# EAGLE design mapleSDuino-V0.1_007-eagle7 (EAGLE 7.6.0)
MAPLE-CUx Large Version
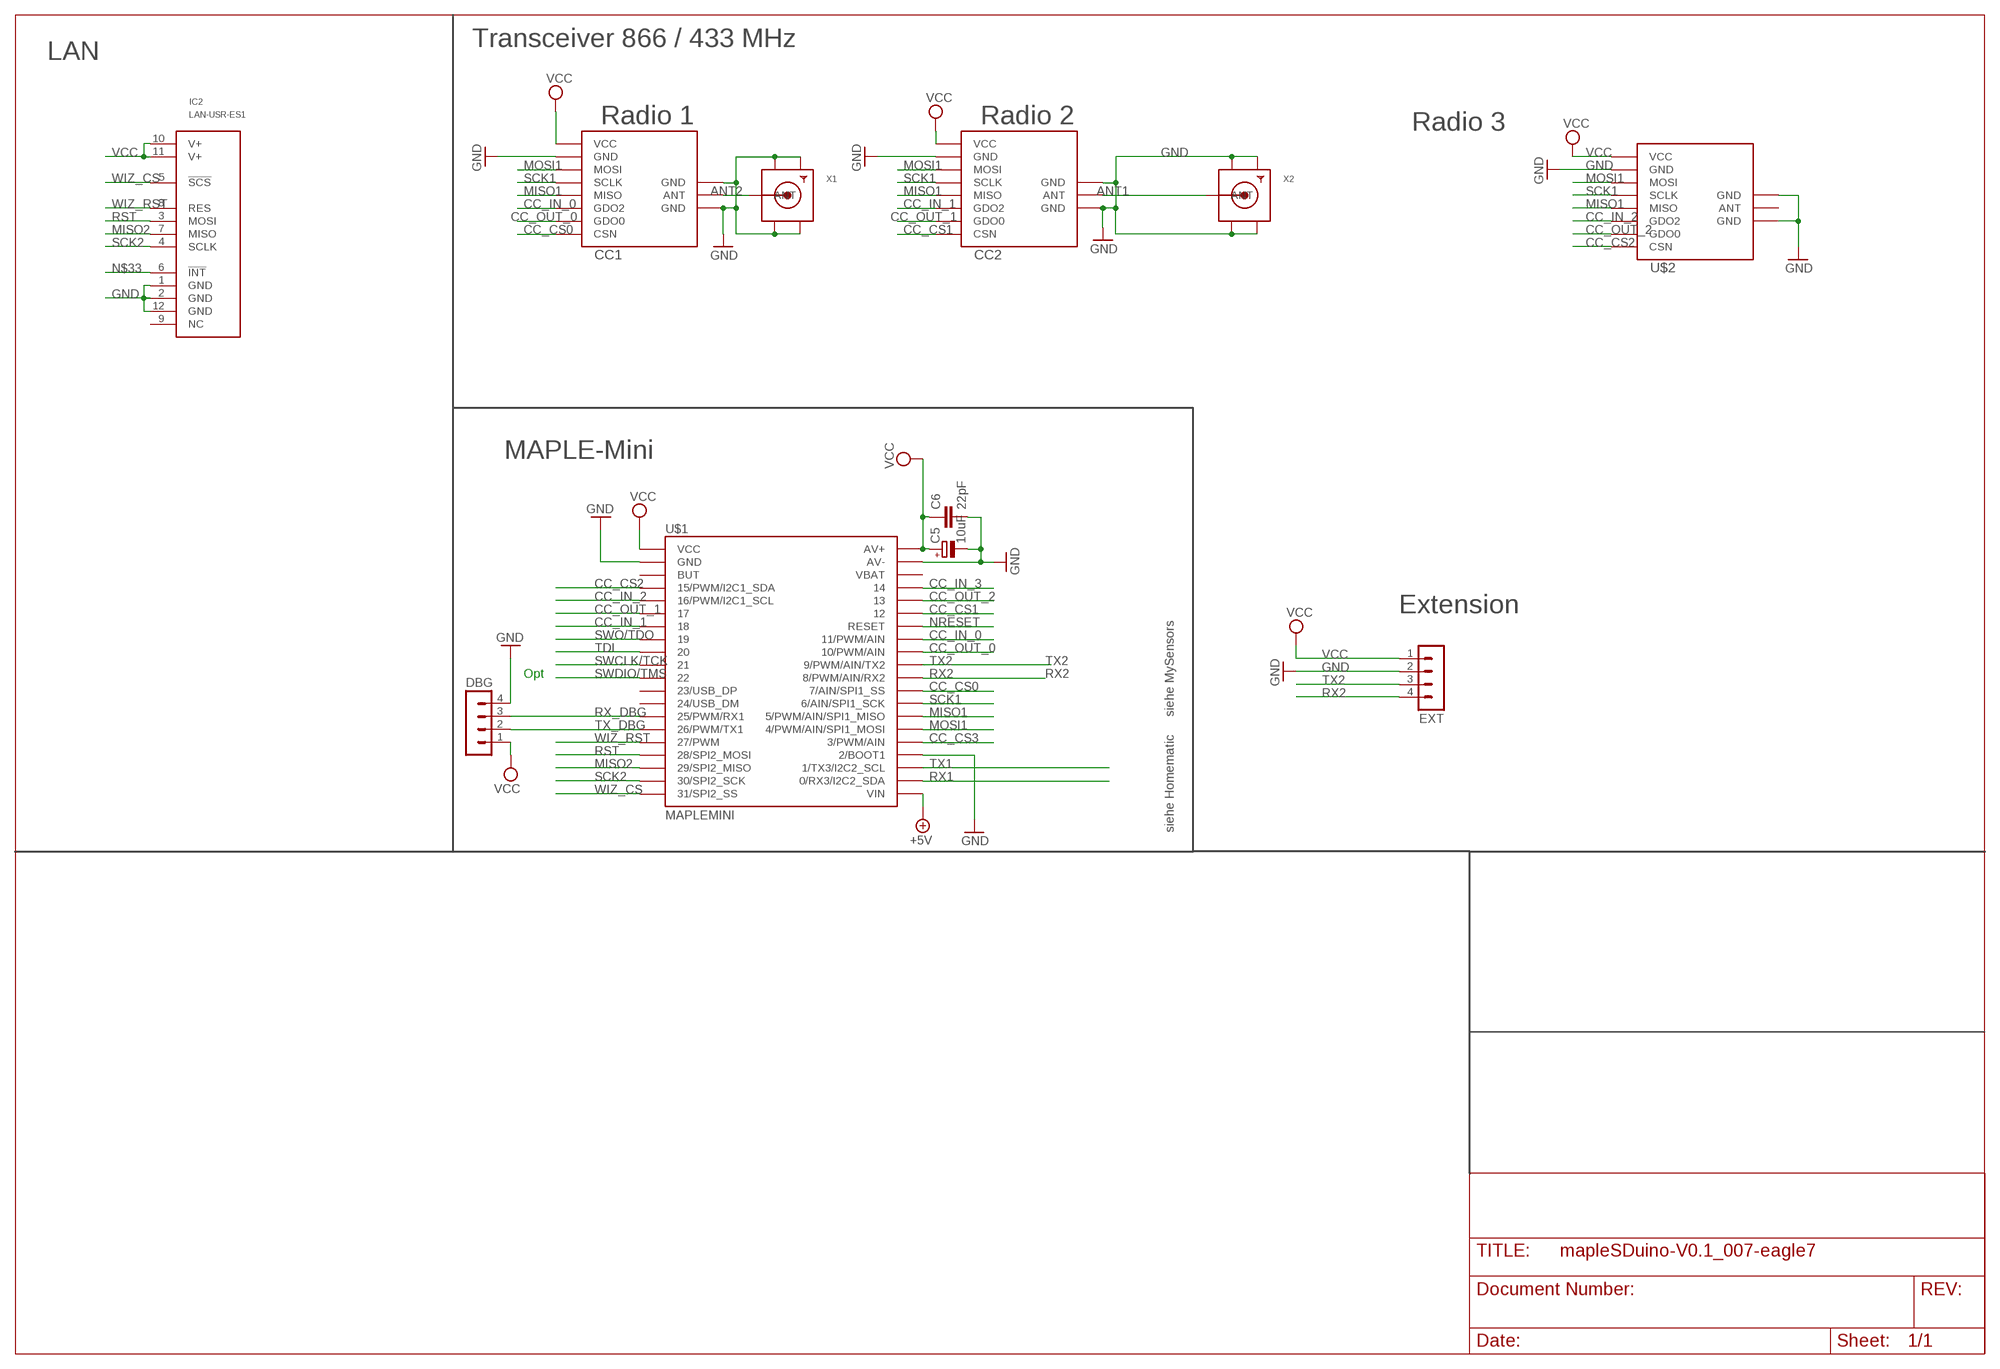
[diagram p0: schematic, sheet 1]

## Parts
C5  10uF  CPOL-EUR/2012-12W  [R/2012-12W]
C6  22pF  C-EUC0805  [C0805]
CC1  CC1101  CC1101_MODULE1SMD  [CC1101_MODULE1_SMD]
CC2  CC1101_MODULE1SMD  [CC1101_MODULE1_SMD]
DBG  MA04-1  [MA04-1]
EXT  MA04-1  [MA04-1]
IC2  LAN-USR-ES1  [USR-ES1]
U$1  MAPLEMINI  [20-DIP]
U$2  CC1101_MODULE1DIL_BIG  [CC1101_MODULE1_DIL-2]
X1  SMACONNECTOR_EDGE  [SMA_EDGELAUNCH]
X2  SMACONNECTOR_EDGE  [SMA_EDGELAUNCH]

## Nets
+5V [PWR]: U$1.21(VIN)
ANT1 [PWR]: CC2.ANT X2.P(ANT)
ANT2: CC1.ANT X1.P(ANT)
CC_CS0: CC1.CSN U$1.29(7/AIN/SPI1_SS)
CC_CS1: CC2.CSN U$1.35
CC_CS2: U$1.4(15/PWM/I2C1_SDA) U$2.8(CSN)
CC_CS3: U$1.25(3/PWM/AIN)
CC_IN_0: CC1.GDO2 U$1.33(11/PWM/AIN)
CC_IN_1: CC2.GDO2 U$1.7
CC_IN_2: U$1.5(16/PWM/I2C1_SCL) U$2.6(GDO2)
CC_IN_3: U$1.37
CC_OUT_0: CC1.GDO0 U$1.32(10/PWM/AIN)
CC_OUT_1: CC2.GDO0 U$1.6
CC_OUT_2: U$1.36 U$2.7(GDO0)
GND [PWR]: C5.- C6.2 CC1.GND@0(GND) CC1.GND@1(GND) CC1.GND@2(GND) CC2.GND@0(GND) CC2.GND@1(GND) CC2.GND@2(GND) DBG.4 EXT.2 IC2.1(GND) IC2.2(GND) IC2.12(GND) U$1.2(GND) U$1.24(2/BOOT1) U$1.39(AV-) U$2.2(GND) U$2.9(GND) U$2.11(GND) X1.GND@1(GND4) X1.GND@2(GND3) X1.GND@3(GND2) X1.GND@4(GND1) X2.GND@1(GND4) X2.GND@2(GND3) X2.GND@3(GND2) X2.GND@4(GND1)
MISO1: CC1.MISO CC2.MISO U$1.27(5/PWM/AIN/SPI1_MISO) U$2.5(MISO)
MISO2: IC2.7(MISO) U$1.18(29/SPI2_MISO)
MOSI1: CC1.MOSI CC2.MOSI U$1.26(4/PWM/AIN/SPI1_MOSI) U$2.3(MOSI)
N$33: IC2.6(!INT!)
NRESET: U$1.34(RESET)
RST: IC2.3(MOSI) U$1.17(28/SPI2_MOSI)
RX1: U$1.22(0/RX3/I2C2_SDA)
RX2: EXT.4 U$1.30(8/PWM/AIN/RX2)
RX_DBG: DBG.3 U$1.14(25/PWM/RX1)
SCK1: CC1.SCLK CC2.SCLK U$1.28(6/AIN/SPI1_SCK) U$2.4(SCLK)
SCK2: IC2.4(SCLK) U$1.19(30/SPI2_SCK)
SWCLK/TCK: U$1.10
SWDIO/TMS: U$1.11
SWO/TDO: U$1.8
TDI: U$1.9
TX1: U$1.23(1/TX3/I2C2_SCL)
TX2: EXT.3 U$1.31(9/PWM/AIN/TX2)
TX_DBG: DBG.2 U$1.15(26/PWM/TX1)
VCC [PWR]: C5.+ C6.1 CC1.VCC CC2.VCC DBG.1 EXT.1 IC2.10(V+) IC2.11(V+) U$1.1(VCC) U$1.40(AV+) U$2.1(VCC)
WIZ_CS: IC2.5(!SCS!) U$1.20(31/SPI2_SS)
WIZ_RST: IC2.8(RES) U$1.16(27/PWM)
Unconnected: IC2.9(NC) U$1.3(BUT) U$1.12(23/USB_DP) U$1.13(24/USB_DM) U$1.38(VBAT) U$2.10(ANT)

## Notes on the sheet
- Transceiver 866 / 433 MHz
- LAN
- Radio 1 | Radio 2 | Radio 3
- MAPLE-Mini
- Extension
- Opt
- siehe MySensors
- siehe Homematic

## Library data of the parts
C5 = rcl:CPOL-EU: POLARIZED CAPACITOR, European symbol
C6 = rcl:C-EU: CAPACITOR, European symbol
CC1 CC2 = wireless:CC1101_MODULE1: CC1101 wireless module for 433/868 MHz (sold from Aliexpress). DIL version for mounting with pin header (and SMD soldering) and SMD only variant available.
DBG EXT = con-lstb:MA04-1: PIN HEADER; OC_FARNELL: unknown; OC_NEWARK: unknown
IC2 = Martin-Communication:LAN-USR-ES1
U$1 = maplemini-small:MAPLEMINI
U$2 = CC1101:CC1101_MODULE1: CC1101 wireless module for 433/868 MHz (sold from Aliexpress). DIL version for mounting with pin header (and SMD soldering) and SMD only variant available.
X1 X2 = adafruit:SMACONNECTOR: SMA Connector 90° DIP SMA Connector, 50 Ohm (4UConnector: 07259)

## Net classes
0 default: width 0.305 mm
1 PWR: width 0.406 mm

## Board
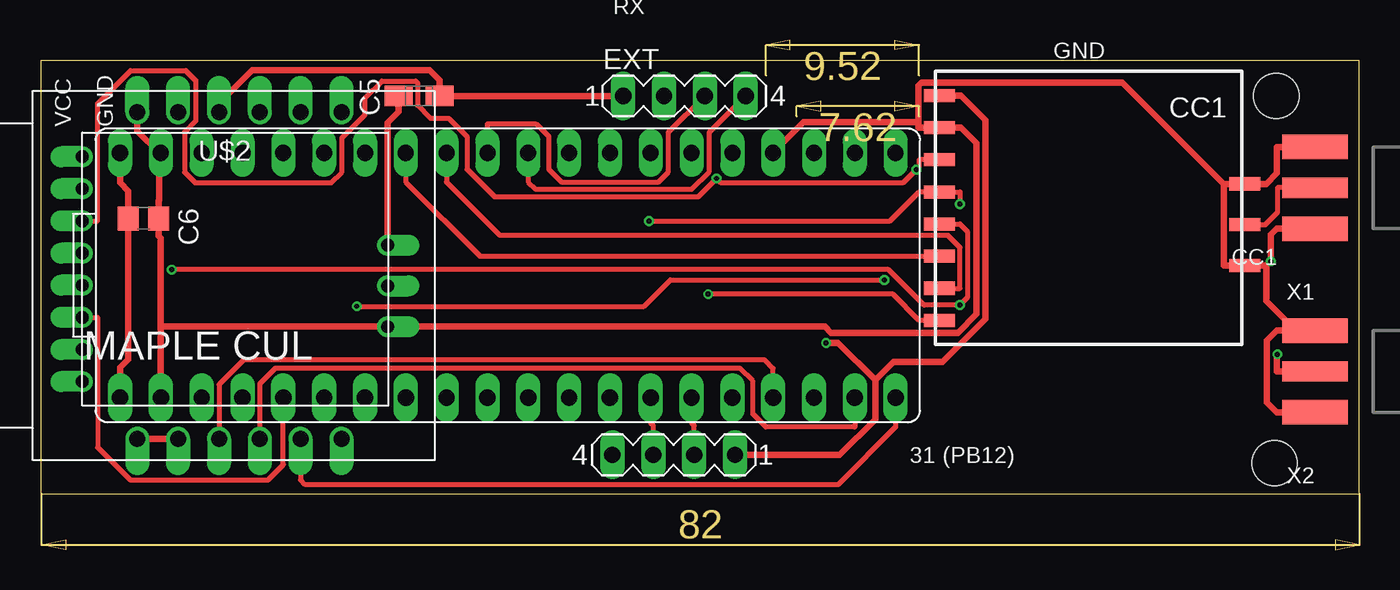
[diagram p1: board, top side]
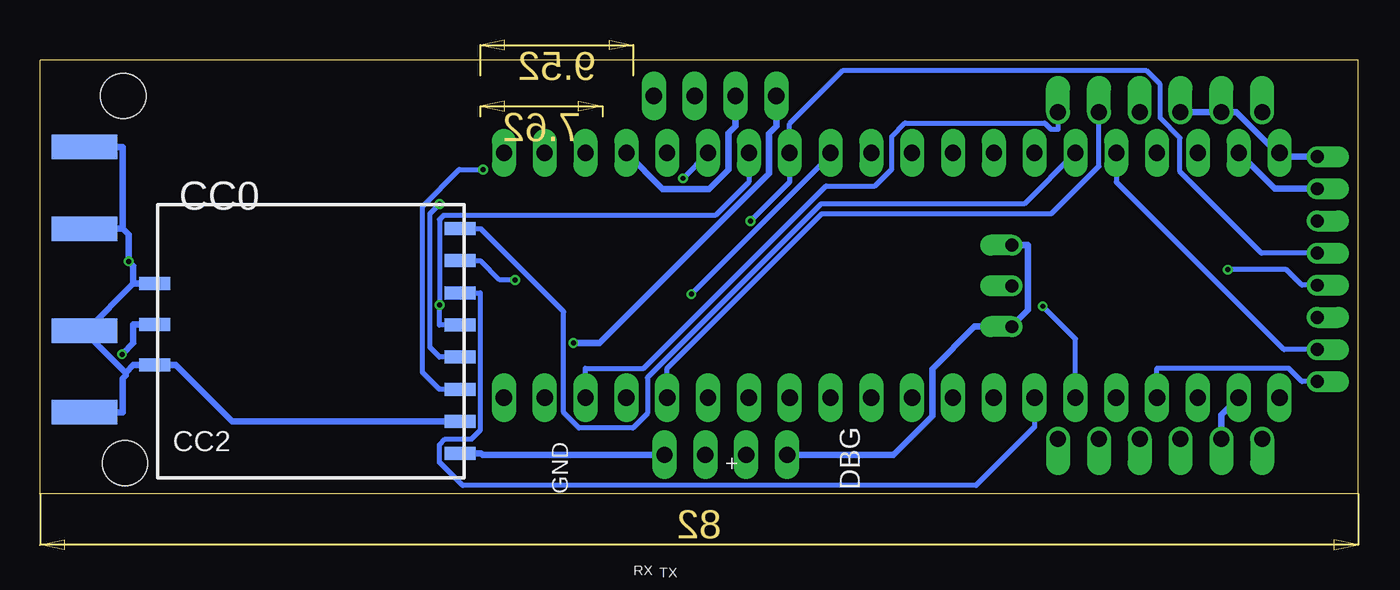
[diagram p2: board, bottom side, seen from below]

Size 82 x 27 mm. Coordinates in mm from the lower left corner, seen from the top.
Outline: 0,0 0,27 82,27 82,0 0,0
Copper layers (1*16): Top 0.035mm / dielectric 1.5mm / Bottom 0.035mm
Design rules "Fusion_eagle_rule_v1.1": minimum track width 6mil, minimum drill 12mil, track to track 6mil, track to pad 6mil, pad to pad 6mil, via to via 6mil, smd to smd 0mil, copper to edge 10mil, drill to drill 10mil, minimum pad ring 10mil, minimum via ring 6mil, stop-mask expansion 2mil, vias tented up to drill 100mil, thermal gap 10mil
Holes 2.8 mm at 76.83,24.77 76.72,1.92
tRestrict: 3 lines
bRestrict: 3 lines

### Footprints (pad centres in the part's own frame; a part is rotated, then mirrored left to right if it is on the bottom)
R/2012-12W = smd 1.75 x 1.26: + 1.275,0; - -1.275,0
C0805 = smd 1.3 x 1.5: 1 -0.95,0; 2 0.95,0
CC1101_MODULE1_SMD = smd 1.93 x 0.813: ANT 19,5.96; CSN 0,0; GDO0 0,2; GDO2 0,4; GND@0 0,12; GND@1 19,8.5; GND@2 19,3.42; MISO 0,6; MOSI 0,10; SCLK 0,8; VCC 0,14
MA04-1 = drill 1.016 long: 1 -3.81,0; 2 -1.27,0; 3 1.27,0; 4 3.81,0
USR-ES1 = drill 1 pad 1.35 offset: 1 -10.16,5.715; 2 -10.16,3.175; 3 -10.16,0.635; 4 -10.16,-1.905; 5 -10.16,-4.445; 6 -10.16,-6.985; 7 10.16,-6.985; 8 10.16,-4.445; 9 10.16,-1.905; 10 10.16,0.635; 11 10.16,3.175; 12 10.16,5.715
20-DIP = drill 1.016 pad 1.27 long: 1 -24.13,-7.62; 2 -21.59,-7.62; 3 -19.05,-7.62; 4 -16.51,-7.62; 5 -13.97,-7.62; 6 -11.43,-7.62; 7 -8.89,-7.62; 8 -6.35,-7.62; 9 -3.81,-7.62; 10 -1.27,-7.62; 11 1.27,-7.62; 12 3.81,-7.62; 13 6.35,-7.62; 14 8.89,-7.62; 15 11.43,-7.62; 16 13.97,-7.62; 17 16.51,-7.62; 18 19.05,-7.62; 19 21.59,-7.62; 20 24.13,-7.62 | drill 1 pad 1.27 long: 21 24.13,7.62; 22 21.59,7.62; 23 19.05,7.62; 24 16.51,7.62; 25 13.97,7.62; 26 11.43,7.62; 27 8.89,7.62; 28 6.35,7.62; 29 3.81,7.62; 30 1.27,7.62; 31 -1.27,7.62; 32 -3.81,7.62; 33 -6.35,7.62; 34 -8.89,7.62; 35 -11.43,7.62; 36 -13.97,7.62; 37 -16.51,7.62; 38 -19.05,7.62; 39 -21.59,7.62; 40 -24.13,7.62
CC1101_MODULE1_DIL-2 = drill 0.8 offset: 1 0,14; 2 0,12; 3 0,10; 4 0,8; 5 0,6; 6 0,4; 7 0,2; 8 0,0; 9 19,8.5; 10 19,5.96; 11 19,3.42
SMA_EDGELAUNCH = smd 4.064 x 1.524: GND@1 2.032,-2.54; GND@2 2.032,2.54 | smd 4.064 x 1.524 bottom: GND@3 2.032,2.54; GND@4 2.032,-2.54 | smd 4.064 x 1.27: P 2.032,0

### Placement (x,y rotation side)
C5  23.5,24.77 0 top
C6  6.35,17.14 0 top
CC1  55.88,10.79 0 top
CC2  55.88,16.51 180 bottom
DBG  39.34,2.42 180 top
EXT  40.01,24.77 0 top
IC2  11.68,13.59 90 top
U$1  29.02,13.61 0 top
U$2  2.54,6.99 0 top
X1  81.28,19.05 180 top
X2  81.28,7.62 180 top

### Tracks (layer width: path | path; a pad name or v marks a point on that pad's centre or on a via)
ANT1  (via drill 0.3 pad 0.61)
  Top 0.406: v76.91,8.69 76.86,8.64 76.86,7.62 X2.P
  Bottom 0.406: v76.91,8.69 76.2,9.39 76.2,10.55 CC2.ANT
ANT2
  Top 0.305: CC1.ANT 76.15,16.75 76.91,17.52 76.91,19.05 X1.P
CC_CS0  (via drill 0.3 pad 0.61)
  Top 0.305: v41.49,12.43 52.98,12.43 54.61,10.79 CC1.CSN
  Bottom 0.305: U$1.29 32.83,21.09 v41.49,12.43
CC_CS1
  Bottom 0.305: U$1.35 20.78,18.04 33.41,18.04 44.22,7.23 44.22,5.01 45.13,4.1 48.48,4.1 49.44,5.06 49.44,11.34 54.61,16.51 CC2.CSN
CC_CS2
  Bottom 0.305: U$1.4 12.51,7.81 4.33,7.81 3.5,6.99 U$2.8
CC_IN_0
  Top 0.305: U$1.33 22.67,19.41 27.29,14.79 CC1.GDO2
CC_IN_1
  Bottom 0.305: CC2.GDO2 54.61,12.51 54.61,3.96 55.16,3.42 56.79,3.42 57.15,3.06 57.15,1.95 55.72,0.51 23.77,0.51 20.13,4.16 U$1.7
CC_IN_2
  Top 0.305: U$2.6 3.5,10.98 3.5,2.89 5.53,0.86 14.1,0.86 15.05,1.81 U$1.5
CC_OUT_0
  Top 0.305: CC1.GDO0 57.15,12.79 57.15,15.34 56.4,16.08 28.54,16.08 25.21,19.41 U$1.32
CC_OUT_1  (via drill 0.3 pad 0.61)
  Top 0.305: v19.62,11.68 37.49,11.68 39.13,13.31 v52.45,13.31
  Bottom 0.305: U$1.6 17.59,9.64 v19.62,11.68 | v52.45,13.31 53.41,13.31 54.61,14.51 CC2.GDO0
CC_OUT_2
  Bottom 0.305: U$1.36 15.05,19.41 4.62,8.98 U$2.7
GND  (via drill 0.3 pad 0.61)
  Top 0.406: 54.56,23.12 54.56,22.8 CC1.GND@0 57.2,22.8 58.18,21.82 58.18,11.18 57.03,10.03 49.13,10.03 48.75,10.4 23.86,10.4 U$2.11 20.53,10.4 7.43,10.4 | 73.56,19.3 67.25,25.61 54.76,25.61 54.56,25.41 54.56,23.12 | 54.56,23.12 47.43,23.12 U$1.24 | 73.56,19.3 73.56,14.21 CC1.GND@2 76.2,14.21 | 7.32,21.23 7.32,18.27 7.3,18.25 C6.2 7.3,16.04 7.43,15.91 7.43,10.4 | IC2.12 5.97,22.58 7.32,21.23 | 7.32,21.23 U$1.39 | 7.43,10.4 7.43,7.87 U$1.2 | 78.05,10.16 76.2,12.01 76.2,14.21 | 78.05,10.16 76.86,10.16 76.25,9.54 76.25,5.7 76.86,5.08 X2.GND@2 | X2.GND@1 78.05,10.16 | 76.2,14.21 76.46,14.47 v76.49,14.47 76.49,16.14 76.86,16.51 X1.GND@2 | 73.56,19.3 CC1.GND@1 76.2,19.3 76.86,19.95 76.86,21.59 X1.GND@1 | C5.- 22.22,23.78 21.54,23.1 U$2.9 | IC2.2 IC2.1
  Bottom 0.406: 76.69,7.52 | 76.69,7.52 76.69,7.37 76.86,7.2 76.86,5.08 X2.GND@2 | 79.11,10.16 79.11,9.95 76.69,7.52 | 76.69,7.52 76.2,8.01 CC2.GND@1 73.56,8.01 70.06,4.51 CC2.GND@0 | 76.2,13.09 79.11,10.18 79.11,10.16 | 79.11,10.16 X2.GND@1 | DBG.4 28.91,2.42 26.48,4.85 26.48,7.78 23.86,10.4 21.58,10.4 | 76.86,16.51 76.49,16.14 v76.49,14.47 76.2,14.18 76.2,13.09 | 76.86,16.51 77,16.51 X1.GND@2 | X1.GND@1 76.86,21.59 76.86,16.51 | CC2.GND@2 76.2,13.09 | U$2.9 20.53,15.48 20.53,11.46 21.58,10.4 | U$2.11 21.58,10.4 | EXT.2 38.73,22.89 39.18,22.44 39.18,20.17 40.38,18.96 43.27,18.96 U$1.24 | U$1.2 8.51,4.91 IC2.2 | U$1.39 5.19,18.98 U$2.2
MISO1  (via drill 0.3 pad 0.61)
  Top 0.305: v8.1,13.95 52.72,13.95 54.92,11.75 v57.15,11.75 57.61,12.22 57.61,16.33 57.15,16.8 CC1.MISO
  Bottom 0.305: U$2.5 3.5,12.98 4.46,13.95 v8.1,13.95 | CC2.MISO 57.15,10.51 v57.15,11.74 v57.15,11.75 57.15,17.08 56.9,17.33 39.99,17.33 37.91,19.41 U$1.27
MISO2
  Bottom 0.305: IC2.7 18.67,22.69 19.11,22.69 19.5,23.08 28.18,23.08 29.02,22.24 29.02,20.21 30.07,19.16 33.1,19.16 44.45,7.81 48.07,7.81 U$1.18
MOSI1  (via drill 0.3 pad 0.61)
  Top 0.305: U$2.3 3.5,16.98 3.5,24.29 5.56,26.34 8.98,26.34 9.6,25.73 9.6,23.23 8.9,22.53 8.9,20.03 9.56,19.37 18.04,19.37 18.7,20.03 18.7,22.16 20.13,23.6 20.13,24.65 21.18,25.7 23.3,25.7 23.4,25.6 23.4,24.18 24.2,23.39 25.34,23.39 26.48,22.25 26.48,20.2 28.18,18.5 40.87,18.5 v42.01,19.64 42.27,19.38 53.64,19.38 v54.44,20.18 54.61,20.35 54.61,20.8 CC1.MOSI
  Bottom 0.305: CC2.MOSI 57.15,6.51 58.21,7.57 58.21,17.89 55.92,20.18 v54.44,20.18 | U$1.26 40.45,21.2 v42.01,19.64
RST
  Top 0.305: U$1.17 45.53,7.81 45.02,8.32 12.57,8.32 11.05,6.8 IC2.3
RX2
  Top 0.305: EXT.4 41.56,22.51 41.56,20.06 40.45,18.95 30.75,18.95 30.29,19.41 U$1.30
RX_DBG
  Top 0.305: DBG.3 38.07,4.25 37.91,4.41 U$1.14
SCK1  (via drill 0.3 pad 0.61)
  Top 0.305: v57.15,18.04 57.15,18.8 CC1.SCLK 54.61,18.8 52.8,16.98 v37.81,16.98
  Bottom 0.305: U$2.4 6.01,14.98 11.08,20.05 11.08,22.16 12.32,23.4 12.32,25.5 13.16,26.34 32.07,26.34 35.37,23.04 U$1.28 35.37,19.41 35.38,19.41 v37.81,16.98 | CC2.SCLK 57.15,8.51 57.75,9.11 57.75,17.43 v57.15,18.04
SCK2
  Top 0.305: U$1.19 50.61,4.16 45.07,4.16 44.26,4.97 44.26,7.01 43.46,7.81 14.56,7.81 13.59,6.85 IC2.4
TX2
  Top 0.305: U$1.31 27.75,23.04 30.77,23.04 31.56,22.25 31.56,20.21 32.36,19.41 38.4,19.41 39.02,20.03 39.02,22.51 EXT.3
TX_DBG
  Top 0.305: DBG.2 40.61,4.25 40.45,4.41 U$1.15
VCC  (via drill 0.3 pad 0.61)
  Top 0.406: IC2.10 11.05,24.31 13.11,26.37 24.15,26.37 24.77,25.75 C5.+ EXT.1 | 51.88,7.07 53.01,8.21 56.05,8.21 58.75,10.9 58.75,23.25 57.2,24.8 CC1.VCC | DBG.1 49.67,2.42 51.88,4.64 51.88,7.07 | v48.83,9.4 49.56,9.4 51.88,7.07 | U$1.40 4.89,19.36 5.4,18.85 C6.1 5.4,8.38 4.89,7.87 U$1.1
  Bottom 0.406: IC2.10 IC2.11 7.58,23.75 5.06,21.23 U$1.40 4.65,20.98 U$2.1 | v48.83,9.4 47.2,9.4 36.66,19.94 36.66,22.42 36.2,22.89 EXT.1 | CC2.VCC 54.56,2.51 54.47,2.42 DBG.1
WIZ_CS
  Top 0.305: IC2.5 16.13,0.86 16.42,0.57 49.56,0.57 53.15,4.16 U$1.20
WIZ_RST
  Bottom 0.305: U$1.16 42.99,7.81 33.37,17.43 19.09,17.43 16.13,20.39 IC2.8

### Text on the board
tNames: GND | TX | RX | GND | VCC | GND | CC1 | MAPLE CUL | 31 (PB12)
bNames: MAPLE CUL | Small V2.0 / www.neuby.de | CC0 | GND | + | TX | RX